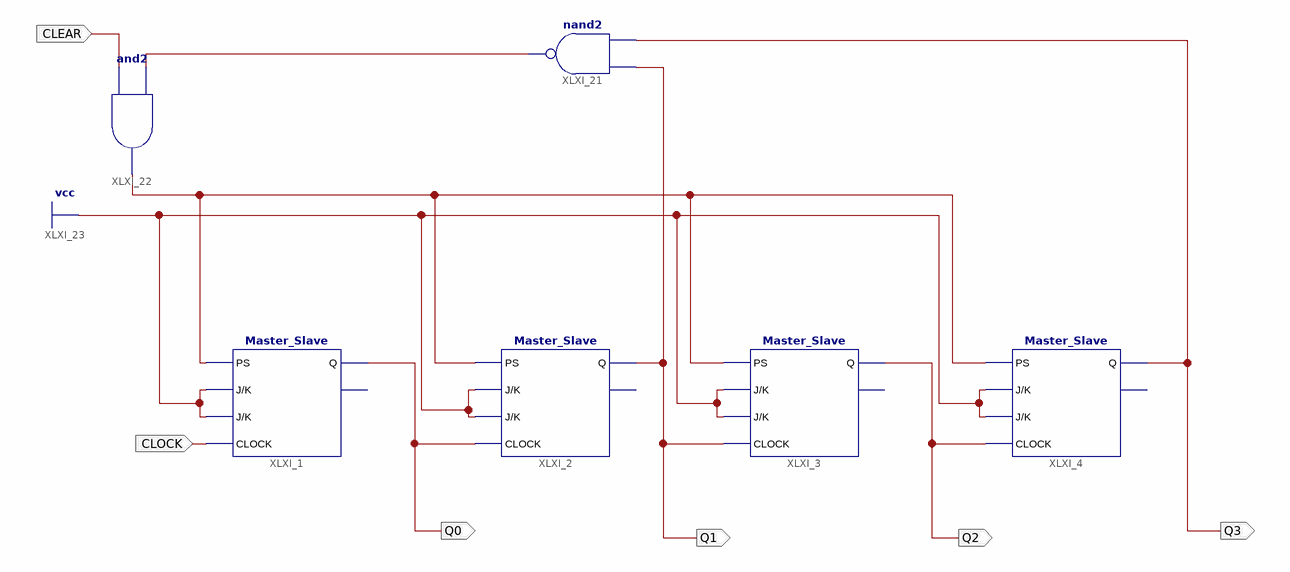
[diagram p0: schematic sheet 1]
// Xilinx ISE schematic MOD_10_Counter.sch (artix7) as structural Verilog: 6 symbols, 6 ports
module MOD_10_Counter (
  input  CLOCK,
  input  CLEAR,
  output Q3,
  output Q2,
  output Q1,
  output Q0
);

  wire XLXN_12, XLXN_48;

  nand XLXI_21 (XLXN_48, Q3, Q1);
  and XLXI_22 (XLXN_12, CLEAR, XLXN_48);
  Master_Slave XLXI_1 (.CLOCK(CLOCK), .J(1'b1), .K(1'b1), .PS(XLXN_12), .Q(Q0));  // open: Qb
  Master_Slave XLXI_2 (.CLOCK(Q0), .J(1'b1), .K(1'b1), .PS(XLXN_12), .Q(Q1));  // open: Qb
  Master_Slave XLXI_3 (.CLOCK(Q1), .J(1'b1), .K(1'b1), .PS(XLXN_12), .Q(Q2));  // open: Qb
  Master_Slave XLXI_4 (.CLOCK(Q2), .J(1'b1), .K(1'b1), .PS(XLXN_12), .Q(Q3));  // open: Qb
endmodule
